# EAGLE design oc76 v3 (EAGLE 9.3.0)
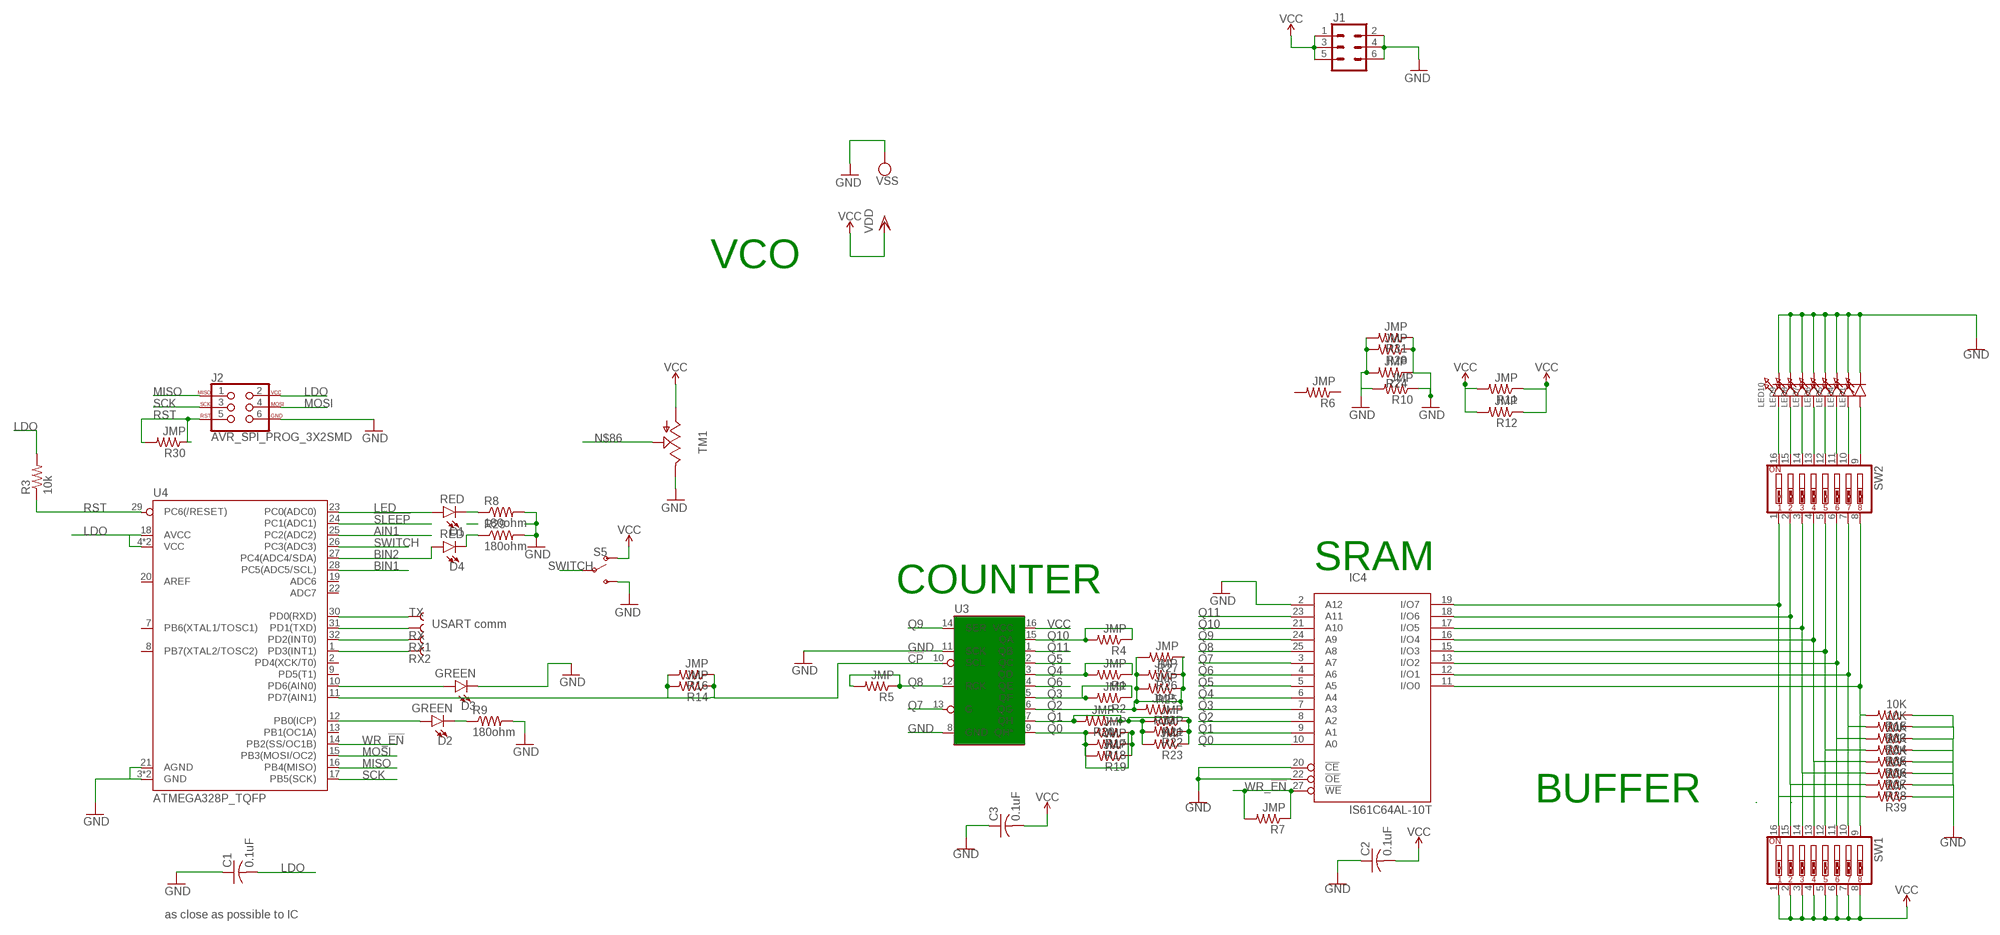
[diagram p0: schematic, sheet 1]

## Parts
C1  0.1uF  C-USC1206  [C1206]
C2  0.1uF  C-USC1206  [C1206]
C3  0.1uF  C-USC1206  [C1206]
D1  RED  LED-RED1206  [LED-1206]
D2  GREEN  LED-RED1206  [LED-1206]
D3  GREEN  LED-RED1206  [LED-1206]
D4  RED  LED-RED1206  [LED-1206]
IC4  IS61C64AL-10T  [TSOP-I-28]
J1  CONN_03X2FEMALE_SMD  [2X3_SMD]
J2  AVR_SPI_PROG_3X2SMD  [2X3_SMT_POSTS]
LED1  LED1206  [CHIPLED_1206]
LED4  LED1206  [CHIPLED_1206]
LED5  LED1206  [CHIPLED_1206]
LED6  LED1206  [CHIPLED_1206]
LED7  LED1206  [CHIPLED_1206]
LED8  LED1206  [CHIPLED_1206]
LED9  LED1206  [CHIPLED_1206]
LED10  LED1206  [CHIPLED_1206]
R1  JMP  R-US_M1206  [M1206]
R2  JMP  R-US_M1206  [M1206]
R3  10k  R-US_R1206  [R1206]
R4  JMP  R-US_M1206  [M1206]
R5  JMP  R-US_M1206  [M1206]
R6  JMP  R-US_M1206  [M1206]
R7  JMP  R-US_M1206  [M1206]
R8  180ohm  R-US_R1206  [R1206]
R9  180ohm  R-US_R1206  [R1206]
R10  JMP  R-US_M1206  [M1206]
R11  JMP  R-US_M1206  [M1206]
R12  JMP  R-US_M1206  [M1206]
R13  JMP  R-US_M1206  [M1206]
R14  JMP  R-US_M1206  [M1206]
R15  10K  R-US_M1206  [M1206]
R16  JMP  R-US_M1206  [M1206]
R17  JMP  R-US_M1206  [M1206]
R18  JMP  R-US_M1206  [M1206]
R19  JMP  R-US_M1206  [M1206]
R20  JMP  R-US_M1206  [M1206]
R21  JMP  R-US_M1206  [M1206]
R22  JMP  R-US_M1206  [M1206]
R23  JMP  R-US_M1206  [M1206]
R24  JMP  R-US_M1206  [M1206]
R25  JMP  R-US_M1206  [M1206]
R26  JMP  R-US_M1206  [M1206]
R27  JMP  R-US_M1206  [M1206]
R28  JMP  R-US_M1206  [M1206]
R29  180ohm  R-US_R1206  [R1206]
R30  JMP  R-US_M1206  [M1206]
R31  JMP  R-US_M1206  [M1206]
R33  10K  R-US_M1206  [M1206]
R34  10K  R-US_M1206  [M1206]
R35  10K  R-US_M1206  [M1206]
R36  10K  R-US_M1206  [M1206]
R37  10K  R-US_M1206  [M1206]
R38  10K  R-US_M1206  [M1206]
R39  10K  R-US_M1206  [M1206]
RX  TEST-POINT3  [PAD.03X.03]
RX1  TEST-POINT3  [PAD.03X.03]
RX2  TEST-POINT3  [PAD.03X.03]
S5  SWITCH-SPDT-SMD-AYZ0202  [SWITCH_DPDT_SMD_AYZ0202]
SW1  DIP-08-SMT-HALFSIZE  [DIPSWITCH-08-50MIL]
SW2  DIP-08-SMT-HALFSIZE  [DIPSWITCH-08-50MIL]
TM1  TRIM  [6MM]
TX  TEST-POINT3  [PAD.03X.03]
U3  74595  [TSSOP16]
U4  ATMEGA328P_TQFP  [TQFP32-08]

## Nets
!CP: R14.1 R14.2 R16.1 R16.2 U3.10(SCL) U4.11(PD7(AIN1))
!SLEEP: U4.24(PC1(ADC1))
AIN1: U4.25(PC2(ADC2))
BIN1: U4.28(PC5(ADC5/SCL))
BIN2: D4.A U4.27(PC4(ADC4/SDA))
GND: C1.1 C2.1 C3.1 D3.C IC4.2(A12) IC4.20(!CE) IC4.22(!OE) J1.2 J1.4 J1.6 J2.6 LED1.C LED4.C LED5.C LED6.C LED7.C LED8.C LED9.C LED10.C R8.2 R9.2 R10.1 R10.2 R15.1 R24.1 R24.2 R28.1 R28.2 R29.2 R31.1 R31.2 R33.1 R34.1 R35.1 R36.1 R37.1 R38.1 R39.1 S5.3(S) TM1.E U3.8(GND) U3.11(SCK) U4.3(GND) U4.5(GND) U4.21(AGND) ; supply symbol labelled VSS
LDO: C1.2 J2.2 R3.2 U4.4(VCC) U4.6(VCC) U4.18(AVCC)
LED: D1.A U4.23(PC0(ADC0))
MISO: J2.1 U4.16(PB4(MISO))
MOSI: J2.4 U4.15(PB3(MOSI/OC2))
N$2: D4.C R29.1
N$3: RX1.P$1 U4.32(PD2(INT0))
N$4: RX2.P$1 U4.1(PD3(INT1))
N$5: D3.A U4.10(PD6(AIN0))
N$14: TX.P$1 U4.30(PD0(RXD))
N$15: RX.P$1 U4.31(PD1(TXD))
N$16: D2.A U4.12(PB0(ICP))
N$17: D1.C R8.1
N$18: D2.C R9.1
N$37: IC4.19(I/O7) R39.2 SW1.16 SW2.1
N$46: IC4.16(I/O4) R36.2 SW1.13 SW2.4
N$47: IC4.18(I/O6) R38.2 SW1.15 SW2.2
N$48: IC4.17(I/O5) R37.2 SW1.14 SW2.3
N$49: IC4.15(I/O3) R35.2 SW1.12 SW2.5
N$50: IC4.13(I/O2) R34.2 SW1.11 SW2.6
N$51: IC4.12(I/O1) R33.2 SW1.10 SW2.7
N$52: IC4.11(I/O0) R15.2 SW1.9 SW2.8
N$53: LED4.A SW2.10
N$55: LED5.A SW2.11
N$57: LED10.A SW2.16
N$58: LED9.A SW2.15
N$59: LED8.A SW2.14
N$60: LED7.A SW2.13
N$61: LED6.A SW2.12
N$62: LED1.A SW2.9
N$86: TM1.S
Q0: IC4.10(A0) R17.1 R17.2 R18.1 R18.2 R19.1 R19.2 U3.9(QH*)
Q1: IC4.9(A1) R20.1 R20.2 R21.1 R21.2 R22.1 R22.2 R23.1 R23.2 U3.7(QH)
Q2: IC4.8(A2) R13.1 R13.2 R25.1 R25.2 R26.1 R26.2 R27.1 R27.2 U3.6(QG)
Q3: IC4.7(A3) R2.1 R2.2 U3.5(QF)
Q4: IC4.6(A4) R1.1 R1.2 U3.3(QD)
Q5: IC4.5(A5) U3.2(QC)
Q6: IC4.4(A6) U3.4(QE)
Q7: IC4.3(A7) U3.13(G)
Q8: IC4.25(A8) R5.1 R5.2 U3.12(RCK)
Q9: IC4.24(A9) U3.14(SER)
Q10: IC4.21(A10) R4.1 R4.2 U3.15(QA)
Q11: IC4.23(A11) U3.1(QB)
RST: J2.5 R3.1 R30.1 R30.2 U4.29(PC6(/RESET))
SCK: J2.3 U4.17(PB5(SCK))
SWITCH: S5.2(P) U4.26(PC3(ADC3))
VCC: C2.2 C3.2 J1.1 J1.3 J1.5 R11.1 R11.2 R12.1 R12.2 S5.1(O) SW1.1 SW1.2 SW1.3 SW1.4 SW1.5 SW1.6 SW1.7 SW1.8 TM1.A U3.16(VCC) ; supply symbol labelled VDD
WR_!EN: IC4.27(!WE) R7.1 R7.2 U4.14(PB2(SS/OC1B))
Unconnected: R6.1 R6.2 U4.2(PD4(XCK/T0)) U4.7(PB6(XTAL1/TOSC1)) U4.8(PB7(XTAL2/TOSC2)) U4.9(PD5(T1)) U4.13(PB1(OC1A)) U4.19(ADC6) U4.20(AREF) U4.22(ADC7)

## Notes on the sheet
- VCO
- SRAM
- COUNTER
- USART comm
- BUFFER
- as close as possible to IC

## Power pins joined to a net without a drawn wire
GND: IC4.14(GND)
VDD: IC4.28(VDD)

## Library data of the parts
C1-C3 = adafruit:C-US: CAPACITOR, American symbol
D1 D4 = SparkFun-LED:LED-RED: Red SMD LED Used in manufacturing of most products at SparkFun Packages: 0603 - SMD 0603 package [Product Link] <http://docs.avagotech.com/docs/AV02-0551EN> 0603 SMART - SMD 0603 SMART package ( more efficient and expensive)[Product Link] <http://www.osram-os.com/Graphics/XPic2/00077099_0.pdf> 1206 - SMD1206 package [Product Link] <https://www.sparkfun.com/datasheets/DevTools/LilyPad/Q150OVS4.pdff> SparkFun Products: Pro Mini 328 -5V <https://www.sparkfun.com/products/821> RedBoard <https://www.sparkfun.com/products/12757> IOIO-OTG <https://www.sparkfun.com/products/13613>; PROD_ID: DIO-09912
D2 D3 = SparkFun-LED:LED-RED: Red SMD LED Used in manufacturing of most products at SparkFun Packages: 0603 - SMD 0603 package [Product Link] <http://docs.avagotech.com/docs/AV02-0551EN> 0603 SMART - SMD 0603 SMART package ( more efficient and expensive)[Product Link] <http://www.osram-os.com/Graphics/XPic2/00077099_0.pdf> 1206 - SMD1206 package [Product Link] <https://www.sparkfun.com/datasheets/DevTools/LilyPad/Q150OVS4.pdff> SparkFun Products: Pro Mini 328 -5V <https://www.sparkfun.com/products/821> RedBoard <https://www.sparkfun.com/products/12757> IOIO-OTG <https://www.sparkfun.com/products/13613>; PROD_ID: DIO-09912; VALUE: RED
IC4 = memory-issi-asynsram:IS61C64AL-*: 8k x 8 high- speed CMOS static RAM 10ns access time 5V power supply
J1 = SparkFun-Connectors:CONN_03X2: Multi connection point. Often used as Generic Header-pin footprint for 0.1 inch spaced/style header connections You can populate with any combo of single row headers, but if you'd like an exact match, check these: Header - 2x3 (Male, 0.1") <https://www.sparkfun.com/products/12807> (PRT-12807) Header - 2x3 (Female, 0.1") <https://www.sparkfun.com/products/13010> (PRT-13010) 2x3 Pin Shrouded Header <https://www.sparkfun.com/products/10877> (PRT-10877) On any of the 0.1 inch spaced packages, you can populate with these: Break Away Headers - Straight <https://www.sparkfun.com/products/116> (PRT-00116) Break Away Male Headers - Right Angle <https://www.sparkfun.com/products/553> (PRT-00553) Female Headers <https://www.sparkfun.com/products/115> (PRT-00115) Break Away Headers - Machine Pin <https://www.sparkfun.com/products/117> (PRT-00117) Break Away Female Headers - Swiss Machine Pin <https://www.sparkfun.com/products/743> (PRT-00743) Special note: the shrouded connector mates well with our 3x2 ribbon cables: Ribbon Crimp Connector - 6-pin (2x3, Female) <https://www.sparkfun.com/products/10651> (PRT-10651) Ribbon Cable - 6 wire (15ft) <https://www.sparkfun.com/products/10646> (PRT-10646); PROD_ID: CONN-11290
J2 = SparkFun-Connectors:AVR_SPI_PROG_3X2: AVR ISP 6 Pin This is the reduced ISP connector for AVR programming. Common on Arduino. This footprint will take up less PCB space and can be used with a 10-pin to 6-pin adapter such as SKU: BOB-08508 **Special note about "TEST_POINT" package. The stop mask is on the top side, so if you want your programming test points to be on the bottom of your board, make sure to place this package on the bottom side of the board. This also ensure that the orientation to program from the bottom side will be correct. SparkFun Products: SparkFun ISP Pogo Adapter <https://www.sparkfun.com/products/11591> - NS Tiny AVR Programmer <https://www.sparkfun.com/products/11801> -PTH
LED1 LED4-LED10 = microbuilder:LED: LED 0603 - 0603 Surface Mount Package 2mA: Green LED - Low Power (3.9mcd, 2ma, 1.7Vf) - Digikey: 475-2709-2-ND Orange LED - Low Power (9.8mcd, 2ma, 1.8Vf) - Digikey: 475-1194-2-ND Red LED - Low Power (5mcd, 2ma, 1.8Vf) - Digikey: 475-1195-2-ND Yellow LED - Low Power (7mcd, 2ma, 1.8Vf) - Digikey: 475-1196-2-ND 5mA: Blue LED - Low Power (17mcd, 5ma, 2.9Vf) - Digikey: LNJ937W8CRACT-ND 0805 - 0805 Surface Mount Package 2mA: Red LED (8.8mcd, 2mA, 1.8Vf, Clear) - Low Power [Digikey: 475-2510-1-ND] Green LED (5mcd, 2mA, 1.8Vf, Clear) - Low Power [Digikey: 475-2730-1-ND] Yellow LED (11.3mcd, 2mA, 1.8Vf, Clear) - Low Power [Digikey: 475-2555-1-ND] 20mA: Red LED (104mcd, 20mA, Diffused) - LS R976 [Digikey: 475-1278-6-ND] Red LED (12mcd, 20mA, 2.0Vf, Clear) - APT2012EC [Digikey: 754-1128-1-ND] Green LED (15mcd, 20mA, 2.2Vf, Clear) - APT2012GC [Digikey: 754-1131-1-ND] Orange LED (160mcd, 20mA, 2.1Vf, Clear) - APT2012SECK [Digikey: 754-1130-1-ND] 1206 - 1206 Surface Mount Package Green LED (26mcd, 20mA, Diffused) - LG N971 [Digikey: 475-1407-6-ND] Red LED (15mcd, 20mA, Diffused) - LH N974 [Digikey: 475-1416-6-ND]
R1-R31 R33-R39 = adafruit:R-US_: RESISTOR, American symbol
RX RX1 RX2 TX = SparkFun-Connectors:TEST-POINT: SparkFun Test Points Bare copper test points for troubleshooting or In-Circuit-Testing. These are used by our Production team for verifying production board runs using pogo-pins on test beds. SparkFun Products: SparkFun LSM9DS1 Breakout <https://www.sparkfun.com/products/13284> SparkFun PSOC <https://www.sparkfun.com/products/13714> SparkFun Load Cell Amplifier <https://www.sparkfun.com/products/13879>
S5 = SparkFun-Switches:SWITCH-SPDT: Single Pole, Double Throw (SPDT) Switch Single-pole, double-throw (SPDT) switch. Variant Overview SMD-AYZ0202 Surface Mount DPDT Switch <https://www.sparkfun.com/products/597> (COM-00597) Used on e.g. LilyPad Arduino USB - ATmega32U4 Board <https://www.sparkfun.com/products/12049> PTH-11.6X4.0MM SPDT Mini Power Switch <https://www.sparkfun.com/products/102> (COM-00102) Used on e.g. SparkFun Simon Says - Through-Hole Soldering Kit <https://www.sparkfun.com/products/10547> (KIT-10547) PTH-11.6X4.0MM-KIT KIT version of SPDT Mini Power Switch - Simplifies soldering by removing tStop of switch pins - only one side can be soldered. PTH-11.6X4.0MM-LOCK LOCK version of SPDT Mini Power Switch - Offset pins hold switch in place for easier soldering. SMD-RIGHT-ANGLE Surface Mount Right Angle Switch <https://www.sparkfun.com/products/10860> (COM-10860) Used on e.g. SparkFun ESP8266 Thing <https://www.sparkfun.com/products/13231>; PROD_ID: SWCH-08179; SF_ID: COM-00597
SW1 SW2 = SparkFun-Retired:DIP-08: DIP Switch 8 Position
TM1 = adafruit:TRIM
U3 = SparkFun-IC-Logic:74*595: 8-Bit Shift Register (Serial to Parallel) Datasheet <http://cdn.sparkfun.com/datasheets/BreakoutBoards/MM74HC595.pdf> SparkFun Products SparkFun Shift Register Breakout - 74HC595 <https://www.sparkfun.com/products/10680> (BOB-10680)
U4 = SparkFun-IC-Microcontroller:ATMEGA328P_TQFP: Popular 328P in QFP Storefront component: ATmega328 - TQFP <https://www.sparkfun.com/products/13448> (COM-13448) Datasheet <http://www.sparkfun.com/datasheets/Components/SMD/ATMega328.pdf> SparkFun Products SparkFun RedBoard - Programmed with Arduino <https://www.sparkfun.com/products/12757> (DEV-12757) Arduino Pro Mini 328 - 5V/16MHz <https://www.sparkfun.com/products/11113> (DEV-11113) Arduino Pro Mini 328 - 3.3V/8MHz <https://www.sparkfun.com/products/11114> (DEV-11114) SparkFun OpenLog <https://www.sparkfun.com/products/13712> (DEV-13712) SparkFun MicroView - OLED Arduino Module <https://www.sparkfun.com/products/12923> (DEV-12923) SparkFun Digital Sandbox <https://www.sparkfun.com/products/12651> (DEV-12651) SparkFun PicoBoard <https://www.sparkfun.com/products/11888> (WIG-11888) Arduino Fio <https://www.sparkfun.com/products/10116> (DEV-10116) LilyPad Arduino 328 Main Board <https://www.sparkfun.com/products/13342> (DEV-13342) SparkFun RedStick <https://www.sparkfun.com/products/13741> (DEV-13741) LilyPad MP3 <https://www.sparkfun.com/products/11013> (DEV-11013) LilyPad Arduino SimpleSnap <https://www.sparkfun.com/products/10941> (DEV-10941) SparkFun Stepoko <https://www.sparkfun.com/products/13899> (ROB-13899) SparkFun Geiger Counter <https://www.sparkfun.com/products/11345> (SEN-11345) SparkFun EL Sequencer <https://www.sparkfun.com/products/12781> (COM-12781) Arduino Pro 328 - 5V/16MHz <https://www.sparkfun.com/products/10915> (DEV-10915) CryptoCape <https://www.sparkfun.com/products/12773> (DEV-12773) SparkFun IR Thermometer Evaluation Board - MLX90614 <https://www.sparkfun.com/products/10740> (SEN-10740) SparkFun RedBot Mainboard <https://www.sparkfun.com/products/12097> (ROB-12097) Arduino Pro 328 - 3.3V/8MHz <https://www.sparkfun.com/products/10914> (DEV-10914) SparkFun Block for Intel® Edison - Arduino <https://www.sparkfun.com/products/13036> (DEV-13036) SparkFun Simon Says - Surface Mount Soldering Kit <https://www.sparkfun.com/products/10935> (KIT-10935) SparkFun 7-Segment Serial Display - Red <https://www.sparkfun.com/products/11441> (COM-11441) SparkFun 7-Segment Serial Display - White <https://www.sparkfun.com/products/11629> (COM-11629) SparkFun 7-Segment Serial Display - Yellow <https://www.sparkfun.com/products/11443> (COM-11443) SparkFun 7-Segment Serial Display - Kelly Green <https://www.sparkfun.com/products/11440> (COM-11440) SparkFun 7-Segment Serial Display - Blue <https://www.sparkfun.com/products/11442> (COM-11442) SparkFun OpenSegment Serial Display - 20mm (Blue) <https://www.sparkfun.com/products/11647> (COM-11647) SparkFun OpenSegment Serial Display - 20mm (Green) <https://www.sparkfun.com/products/11646> (COM-11646) SparkFun OpenSegment Serial Display - 20mm (White) <https://www.sparkfun.com/products/11648> (COM-11648) SparkFun OpenSegment Serial Display - 20mm (Red) <https://www.sparkfun.com/products/11644> (COM-11644) SparkFun OpenSegment Serial Display - 20mm (Yellow) <https://www.sparkfun.com/products/11645> (COM-11645) SparkFun OpenSegment Shield <https://www.sparkfun.com/products/13190> (DEV-13190); PROD_ID: IC-09069

## Board
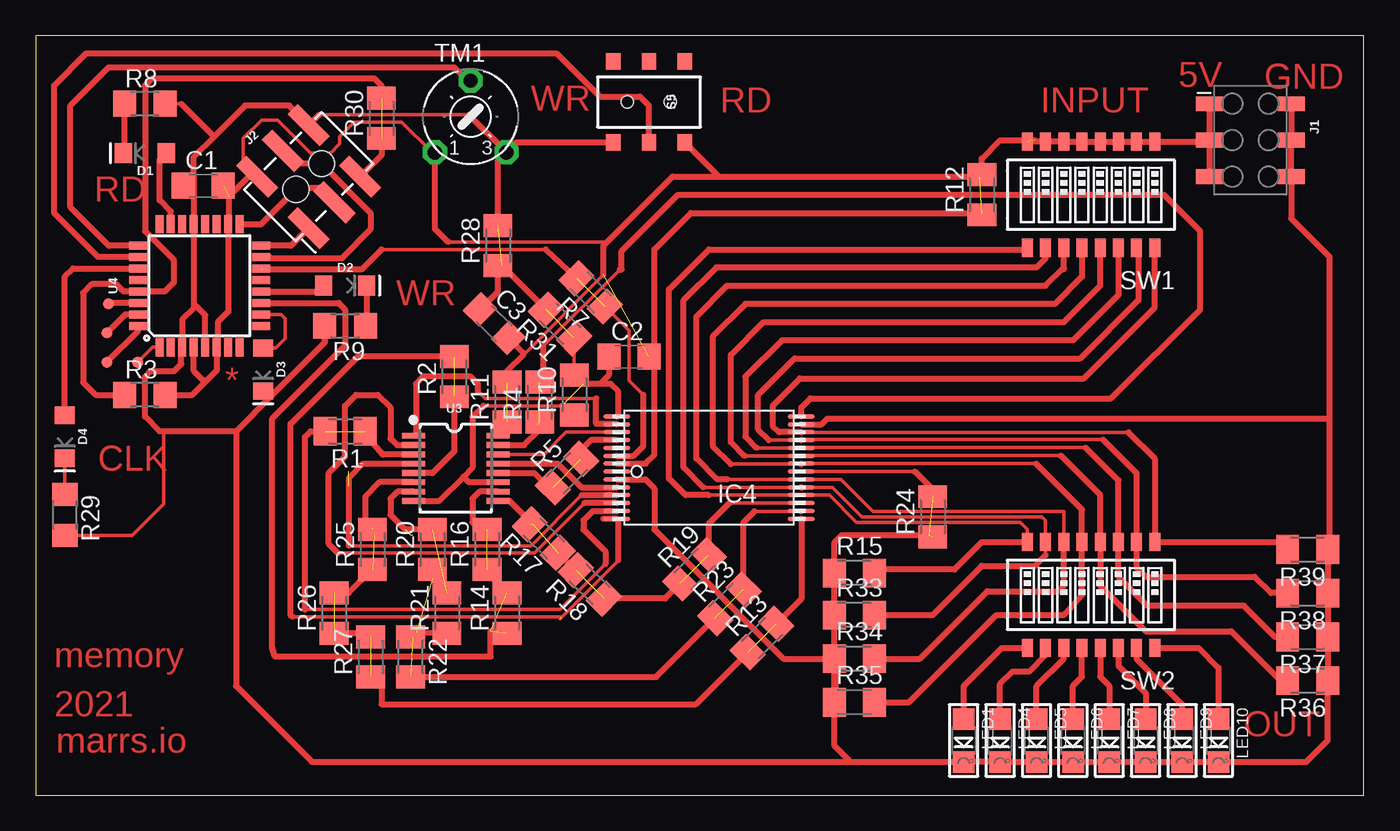
[diagram p1: board, top side]

Size 92.69 x 53.01 mm. Coordinates in mm from the lower left corner, seen from the top.
Outline: 0,0 92.69,0 92.69,53.01 0,53.01 0,0
Copper layers (1*16): Top 0.035mm / dielectric 1.5mm / Bottom 0.035mm
Design rules "default *": minimum track width 10mil, minimum drill 0.35mm, track to track 6mil, track to pad 6mil, pad to pad 6mil, via to via 6mil, smd to smd 6mil, copper to edge 40mil, drill to drill 6mil, minimum pad ring 10mil, minimum via ring 8mil, stop-mask expansion 4mil, vias tented up to drill 0mil, thermal gap 10mil

### Footprints (pad centres in the part's own frame; a part is rotated, then mirrored left to right if it is on the bottom)
C1206 = smd 1.6 x 1.8: 1 -1.4,0; 2 1.4,0
LED-1206 = smd 1.2 x 1.4: A -1.5,0; C 1.5,0
TSOP-I-28 = smd 0.33 x 1.9: 1 -0.275,6.45; 2 -0.825,6.45; 3 -1.375,6.45; 4 -1.925,6.45; 5 -2.475,6.45; 6 -3.025,6.45; 7 -3.575,6.45; 8 -3.575,-6.45; 9 -3.025,-6.45; 10 -2.475,-6.45; 11 -1.925,-6.45; 12 -1.375,-6.45; 13 -0.825,-6.45; 14 -0.275,-6.45; 15 0.275,-6.45; 16 0.825,-6.45; 17 1.375,-6.45; 18 1.925,-6.45; 19 2.475,-6.45; 20 3.025,-6.45; 21 3.575,-6.45; 22 3.575,6.45; 23 3.025,6.45; 24 2.475,6.45; 25 1.925,6.45; 26 1.375,6.45; 27 0.825,6.45; 28 0.275,6.45
2X3_SMD = smd 1.02 x 1.9: 1 -2.54,-2.85; 2 -2.54,2.85; 3 0,-2.85; 4 0,2.85; 5 2.54,-2.85; 6 2.54,2.85
2X3_SMT_POSTS = smd 1 x 3.17: 1 -2.54,-2.54; 2 -2.54,2.54; 3 0,-2.54; 4 0,2.54; 5 2.54,-2.54; 6 2.54,2.54 | hole 1.8: -1.27,0; 1.27,0
CHIPLED_1206 = smd 1.5 x 1.5: A 0,-1.496; C 0,1.496
M1206 = smd 1.6 x 2: 1 -1.4,0; 2 1.4,0
R1206 = smd 1.6 x 1.803: 1 -1.422,0; 2 1.422,0
PAD.03X.03 = smd 0.762 x 0.762: P$1 0,0
SWITCH_DPDT_SMD_AYZ0202 = smd 1 x 1.15: 1 -2.5,2.825; 2 0,2.825; 3 2.5,2.825; 4 -2.5,-2.825; 5 0,-2.825; 6 2.5,-2.825 | hole 0.85: 1.5,0; -1.5,0
DIPSWITCH-08-50MIL = smd 0.762 x 1.27: 1 -4.445,-3.7; 2 -3.175,-3.7; 3 -1.905,-3.7; 4 -0.635,-3.7; 5 0.635,-3.7; 6 1.905,-3.7; 7 3.175,-3.7; 8 4.445,-3.7; 9 4.445,3.7; 10 3.175,3.7; 11 1.905,3.7; 12 0.635,3.7; 13 -0.635,3.7; 14 -1.905,3.7; 15 -3.175,3.7; 16 -4.445,3.7
6MM = drill 1 pad 1.676 octagon: A -2.5,-2.5; E 2.5,-2.5; S 0,2.5
TSSOP16 = smd 0.4 x 1.6: 1 -2.225,-2.85; 2 -1.575,-2.85; 3 -0.925,-2.85; 4 -0.275,-2.85; 5 0.375,-2.85; 6 1.025,-2.85; 7 1.675,-2.85; 8 2.325,-2.85; 9 2.325,3.05; 10 1.675,3.05; 11 1.025,3.05; 12 0.375,3.05; 13 -0.275,3.05; 14 -0.925,3.05; 15 -1.575,3.05; 16 -2.225,3.05
TQFP32-08 = smd 1.27 x 0.559: 1 -4.293,2.8; 2 -4.293,2; 3 -4.293,1.2; 4 -4.293,0.4; 5 -4.293,-0.4; 6 -4.293,-1.2; 7 -4.293,-2; 8 -4.293,-2.8; 17 4.293,-2.8; 18 4.293,-2; 19 4.293,-1.2; 20 4.293,-0.4; 21 4.293,0.4; 22 4.293,1.2; 23 4.293,2; 24 4.293,2.8 | smd 0.559 x 1.27: 9 -2.8,-4.293; 10 -2,-4.293; 11 -1.2,-4.293; 12 -0.4,-4.293; 13 0.4,-4.293; 14 1.2,-4.293; 15 2,-4.293; 16 2.8,-4.293; 25 2.8,4.293; 26 2,4.293; 27 1.2,4.293; 28 0.4,4.293; 29 -0.4,4.293; 30 -1.2,4.293; 31 -2,4.293; 32 -2.8,4.293

### Placement (x,y rotation side)
C1  11.68,42.55 0 top
C2  41.4,30.61 0 top
C3  31.99,32.91 315 top
D1  7.62,44.83 180 top
D2  21.59,35.56 0 top
D3  15.88,29.72 270 top
D4  2.03,25.02 270 top
IC4  46.99,22.86 90 top
J1  84.78,45.72 270 top
J2  19.05,43.18 45 top
LED1  64.77,3.81 180 top
LED4  67.31,3.81 180 top
LED5  69.85,3.81 180 top
LED6  72.39,3.81 180 top
LED7  74.93,3.81 180 top
LED8  77.47,3.81 180 top
LED9  80.01,3.81 180 top
LED10  82.55,3.81 180 top
R1  21.59,25.4 180 top
R2  29.21,29.21 90 top
R3  7.62,27.94 0 top
R4  35.18,27.43 90 top
R5  37.08,22.48 45 top
R6  73.66,64.77 0 top  (outside the outline)
R7  38.73,35.1 135 top
R8  7.62,48.26 0 top
R9  21.59,32.77 180 top
R10  37.59,27.94 90 top
R11  32.89,27.43 90 top
R12  66.04,41.91 90 top
R13  50.69,10.97 45 top
R14  32.89,12.7 90 top
R15  57.15,15.49 0 top
R16  31.5,17.14 90 top
R17  35.45,17.91 135 top
R18  38.67,14.72 135 top
R19  45.97,15.77 45 top
R20  27.69,17.14 90 top
R21  28.7,12.7 90 top
R22  26.16,9.65 270 top
R23  48.41,13.36 45 top
R24  62.61,19.43 90 top
R25  23.49,17.14 90 top
R26  20.83,12.7 90 top
R27  23.37,9.65 90 top
R28  32.26,38.35 90 top
R29  2.03,19.56 270 top
R30  24.13,47.24 90 top
R31  36.6,32.89 135 top
R33  57.15,12.57 0 top
R34  57.15,9.53 0 top
R35  57.15,6.48 0 top
R36  88.77,8 180 top
R37  88.77,11.05 180 top
R38  88.77,14.1 180 top
R39  88.77,17.14 180 top
RX  4.95,32.26 0 top
RX1  4.95,30.23 0 top
RX2  7.11,30.23 0 top
S5  42.8,48.39 180 top
SW1  73.66,41.91 180 top
SW2  73.66,13.97 180 top
TM1  30.35,47.37 0 top
TX  5.08,34.29 0 top
U3  29.21,22.86 270 top
U4  11.43,35.56 90 top

### Tracks (layer width: path | path; a pad name or v marks a point on that pad's centre or on a via)
!CP  (3 unrouted)
  Top 0.406: U3.10 30.96,21.19 30.48,20.7 30.48,19.05 30.98,18.55 R16.2 | U4.11 21.14,34.36 21.59,33.91 21.59,31.37 16.51,26.29 16.51,10.29 16.72,9.65 31.75,9.65 31.75,11.43 | R14.2 31.5,15.5 R16.1
AIN1
  Top 0.406: U4.25 5.1,38.36 2.41,41.05 2.41,48.13 5.08,50.8 29.21,50.8 29.87,50.14 30.48,49.53
BIN2
  Top 0.406: D4.A 2.03,36.2 2.6,36.76 U4.27
GND  (5 unrouted)
  Top 0.254: R10.1 36.7,27.18 31.24,27.18 | IC4.14 61.36,22.59 | 30.23,47.5 19.78,47.5 | R29.2 6.73,18.14 8.91,20.32 8.91,25.38 8.89,25.4 | 10.16,48.26 R8.2 | R31.1 R10.2 | D3.C 16.15,27.94 16.51,27.94
  Top 0.406: 40.56,26.42 IC4.22 40.64,26.53 40.64,28.19 40.13,28.7 39.37,28.7 | LED1.C LED4.C LED5.C LED6.C LED7.C LED8.C LED9.C LED10.C 88.67,2.31 90.17,3.81 R36.1 R37.1 R38.1 R39.1 90.3,17.27 90.3,26.16 | LED1.C 64.54,2.54 | R34.1 R33.1 R15.1 55.75,17.65 56.26,18.16 62.36,18.16 | R35.1 R34.1 | 55.88,8.89 R35.1 | 12.45,45.97 14.61,48.13 17.69,48.13 J2.6 19.78,47.5 | 12.45,45.97 11.03,44.56 11.03,43.18 | 11.03,43.18 U4.21 11.03,34.02 | 56.87,2.31 LED1.C | 55.75,5.46 55.75,3.43 56.87,2.31 | 55.75,5.46 R35.1 | U4.5 11.83,33.51 11.18,34.16 11.03,34.02 | 11.03,34.02 10.23,33.22 U4.3 10.16,31.2 10.16,30.1 9.65,29.59 8,29.59 7.62,29.21 7.62,26.42 8.64,25.4 8.89,25.4 13.97,25.4 | J1.2 J1.4 J1.6 87.63,40.26 90.3,37.59 90.3,26.16 | U3.8 28.15,20.53 29.85,22.23 | IC4.2 42.55,22.03 43.18,21.4 43.18,18.54 52.2,9.53 R34.1 | IC4.20 54.84,25.89 55.25,26.29 90.17,26.29 90.3,26.16 | 12.45,45.97 10.16,48.26 | R9.2 20.17,31.6 16.51,27.94 13.97,25.4 | 39.37,28.7 38.23,28.7 R10.2 | 29.85,22.23 30.48,22.86 30.48,26.42 31.24,27.18 | U3.11 30.23,21.84 29.85,22.23 | 13.97,25.4 13.97,7.62 19.28,2.31 56.87,2.31 | 55.75,5.46 | C1.1 10.92,43.18 11.03,43.18 | R24.2 62.61,21.34 61.36,22.59 | TM1.E 30.23,47.5 | S5.3 33.54,45.56 TM1.E | R28.2 32.26,44.28 TM1.E | R31.2 32.54,36.95 R28.1 32.26,35.16 C3.1 | C2.1 40,29.34 39.37,28.7
LDO  (1 unrouted)
  Top 0.406: J2.2 14.86,43.18 13.46,41.78 13.46,39.89 U4.18 13.43,33.75 12.7,33.02 12.7,31.34 U4.6 12.63,29.65 11.94,28.96 | U4.4 11.03,29.61 11.68,28.96 11.94,28.96 | R3.2 10.92,27.94 11.94,28.96
LED
  Top 0.406: U4.23 9.43,40.73 8.64,41.53 8.64,44.35 D1.A
MISO
  Top 0.406: J2.1 17.82,38.36 U4.16
MOSI
  Top 0.406: U4.15 16.29,37.56 16.38,37.47 21.34,37.47 23.37,39.5 23.37,40.64 19.94,44.07 18.16,44.07 J2.4
N$2
  Top 0.254: D4.C R29.1
N$3
  Top 0.406: RX1.P$1 7.14,32.41 U4.32
N$4
  Top 0.254: RX2.P$1 8.15,31.27 U4.1
N$5
  Top 0.254: U4.10 17.11,33.56 17.4,33.27 17.4,31.88 16.74,31.22 D3.A
N$14
  Top 0.406: U4.30 5.15,34.36 TX.P$1
N$15
  Top 0.406: U4.31 6.25,33.56 RX.P$1
N$16
  Top 0.406: U4.12 19.86,35.16 D2.A
N$17
  Top 0.406: D1.C 6.2,44.91 R8.1
N$18
  Top 0.406: D2.C 23.09,32.84 R9.1
N$37  (1 unrouted)
  Top 0.254: 76.27,25.33 53.47,25.33
  Top 0.406: 76.27,25.33 78.1,23.5 SW2.1 86.85,17.67 R39.2 | 53.47,25.33 53.45,25.34 | IC4.19 51.88,25.34 51.44,25.78 51.44,27.18 53.34,29.08 73.15,29.08 78.1,34.04 SW1.16
N$46  (2 unrouted)
  Top 0.254: 71.55,23.7 53.44,23.7 | 49.48,23.68 53.18,23.68
  Top 0.406: 71.55,23.7 74.3,20.95 SW2.4 74.3,14.61 77.47,11.43 83.44,11.43 86.87,8 R36.2 | 74.27,37.8 SW1.13 74.3,35.56 71.75,33.02 50.8,33.02 48.51,30.73 48.51,24.64 49.48,23.68
N$47
  Top 0.254: 53.47,24.82 74.5,24.82 | IC4.18 51.16,24.78
  Top 0.406: 74.5,24.82 76.83,22.48 SW2.2 76.83,15.88 77.47,15.24 85.09,15.24 86.23,14.1 R38.2 | IC4.18 53.47,24.82 | 51.16,24.78 50.42,25.53 50.42,27.94 52.96,30.48 72.9,30.48 76.96,34.54 76.96,38.22 76.73,38.44 76.86,38.31 SW1.15
N$48  (1 unrouted)
  Top 0.254: 53.46,24.26 73.28,24.26 | IC4.17 50.31,24.23
  Top 0.406: 73.28,24.26 75.56,21.97 SW2.3 75.56,15.24 77.6,13.21 84.32,13.21 86.48,11.05 R37.2 | 50.31,24.23 49.53,25.02 49.53,29.21 52.07,31.75 72.39,31.75 75.56,34.92 SW1.14
N$49  (1 unrouted)
  Top 0.254: 69.82,23.14 IC4.15 | 53.42,23.11 48.51,23.11
  Top 0.406: 69.82,23.14 73.02,19.94 SW2.5 73.02,13.97 71.88,12.7 71.75,12.57 67.06,12.57 60.96,6.48 R35.2 | IC4.15 53.42,23.11 | 48.51,23.11 47.24,24.38 47.24,32 49.53,34.29 71.12,34.29 73.02,36.2 SW1.12 73,37.93
N$50
  Top 0.254: SW2.6 71.75,19.81 58.42,19.81 56.2,22.03 IC4.13 48.26,22.03
  Top 0.406: SW2.6 71.75,14.61 71.37,14.22 66.42,14.22 61.72,9.53 R34.2 | 71.75,36.83 SW1.11 | 71.75,36.83 71.75,36.7 | 71.75,36.83 70.48,35.56 48.26,35.56 46.1,33.4 46.1,23.5 47.56,22.03 48.26,22.03
N$51
  Top 0.254: 46.59,21.48 IC4.12 55.6,21.48 57.66,19.43 70.23,19.43 70.48,19.18 SW2.7 70.48,16.76
  Top 0.406: 53.46,21.46 IC4.12 | SW1.10 70.48,37.47 69.85,36.83 47.5,36.83 45.21,34.54 45.21,22.86 46.59,21.48 | R33.2 62.61,12.57 66.04,16 69.72,16 70.48,16.76
N$52
  Top 0.254: 46.99,20.94 IC4.11 55.39,20.94 57.28,19.05 68.72,19.05 69.21,18.56 SW2.8
  Top 0.406: R15.2 58.8,15.75 64.13,15.75 66.06,17.67 SW2.8 | SW1.9 69.1,38.1 46.99,38.1 44.2,35.31 44.2,22.1 45.36,20.94 46.99,20.94
N$53
  Top 0.406: LED4.A 67.31,7.75 68.2,8.64 69.34,8.64 70.48,9.78 SW2.10
N$55
  Top 0.406: LED5.A 69.85,7.62 71.75,9.53 SW2.11
N$57
  Top 0.406: SW2.16 81.17,10.27 82.55,8.89 LED10.A
N$58
  Top 0.406: SW2.15 76.83,9.53 80.01,6.35 LED9.A
N$59
  Top 0.406: SW2.14 75.56,9.02 77.47,7.11 LED8.A
N$60
  Top 0.406: SW2.13 74.3,8.26 74.93,7.62 LED7.A
N$61
  Top 0.406: LED6.A 72.39,7.62 73.02,8.26 SW2.12
N$62
  Top 0.406: LED1.A 64.77,7.62 67.42,10.27 SW2.9
N$86
  Top 0.254: TM1.S 30.14,49.87 29.85,50.17
Q0  (4 unrouted)
  Top 0.254: IC4.10 48.43,20.39
  Top 0.406: U3.9 33.06,20.53 34.67,18.92 | 48.43,20.39 46.96,18.92 R19.2 | R19.1 43.94,13.73 R18.1 | R18.2 37.66,15.71 R17.1
Q1  (6 unrouted)
  Top 0.254: 50.16,19.81 53.42,19.81
  Top 0.406: IC4.9 53.42,19.81 | U3.7 25.25,21.19 24.76,20.7 24.76,19.56 25.78,18.55 R20.2 | R23.2 49.4,19.05 50.16,19.81 | R21.1 26.55,11.31 26.29,11.05 R22.1 | R22.2 43.3,8.25 R23.1 | R20.1 27.69,15.12 R21.2
Q2  (5 unrouted)
  Top 0.406: U3.6 26.35,21.84 24,21.84 22.99,20.83 22.99,18.67 23.49,18.67 23.62,18.16 23.62,18.29 | IC4.8 53.44,13.71 R13.2 | R13.1 46.08,6.35 24.13,6.35 24.13,7.49 R27.1 | R27.2 23.12,11.3 R26.1 | R26.2 21.85,14.1 R25.1
Q3  (2 unrouted)
  Top 0.254: 36.7,12.45 17.91,12.45 | 40.67,16.38 36.58,12.29
  Top 0.406: 39.61,19.28 IC4.7 40.67,19.16 40.67,16.38 | U3.5 27.69,22.48 29.21,24 R2.1 | R2.2 22.48,30.61 17.78,25.91 17.78,12.57 17.91,12.45
Q4  (1 unrouted)
  Top 0.254: 18.8,12.95 36.58,12.95 39.75,16.13
  Top 0.406: IC4.6 40.52,19.81 38.86,19.81 38.23,19.18 38.23,18.54 39.75,17.02 39.75,16.13 | 18.8,12.95 18.8,25.02 19.18,25.4 R1.2 | U3.3 24.22,23.78 24.26,23.75 23.37,24.77 R1.1
Q5
  Top 0.254: 38.29,20.39 34.8,16.89 21.08,16.89
  Top 0.406: IC4.5 38.29,20.39 | U3.2 25.22,24.44 24.76,24.89 24.76,27.05 23.88,27.94 22.35,27.94 21.59,27.18 21.59,23.62 20.45,22.48 20.45,17.53 21.08,16.89
Q6  (3 unrouted)
  Top 0.254: 38.1,20.94 34.56,17.4 21.84,17.4
  Top 0.406: 38.1,20.94 IC4.4 | 21.84,17.4 21.84,22.12 22.86,23.14 U3.4
Q7
  Top 0.406: U3.13 36.43,23.14 38.08,21.48 IC4.3
Q8  (1 unrouted)
  Top 0.406: U3.12 34.8,22.48 35.79,21.49 R5.1 | IC4.25 38.76,24.78 38.07,24.1 R5.2
Q9
  Top 0.254: U3.14 35.47,23.78 37.02,25.34 IC4.24
Q10  (2 unrouted)
  Top 0.254: 35.43,31.37 40.77,36.7
  Top 0.406: IC4.21 53.44,27.07 54.06,27.69 75.06,27.69 81.28,33.91 81.28,39.37 78.74,41.91 44.83,41.91 40.89,37.97 40.89,36.7 40.77,36.7 | U3.15 34.09,24.44 35.05,25.4 35.05,25.91 | 35.43,31.37 35.43,29.09 R4.2
Q11
  Top 0.254: 30.86,28.19 31.37,27.69 39.12,27.69
  Top 0.406: IC4.23 40.52,25.91 39.12,25.91 39.12,27.69 | U3.1 26.54,25.27 26.54,28.7 27.05,29.21 30.35,29.21 30.86,28.7 30.86,28.19
RST  (1 unrouted)
  Top 0.254: R30.1 24.13,45.72
  Top 0.406: 22.99,43.53 J2.5 24.13,44.67 24.13,45.72 | R3.1 4.17,27.94 3.3,28.8 3.3,35.05 3.92,35.67 5.61,35.67 6.12,35.16 U4.29 9,35.16 9.65,35.81 9.65,37.34 7.62,39.37 7.62,49.53 8.13,50.04 23.62,50.04 24.13,49.53 R30.2
SCK
  Top 0.406: U4.17 15.72,39.85 18.29,42.42 19.81,42.42 J2.3
SWITCH
  Top 0.406: U4.26 4.35,37.56 1.27,40.64 1.27,49.53 3.53,51.79 36.35,51.79 39.37,48.77 42.16,48.77 42.8,48.13 S5.2
VCC  (4 unrouted)
  Top 0.254: 34.04,30.73 39.62,36.32 | 28.78,38.61 39.88,38.61 | TM1.A 27.65,44.87 25.53,46.99 22.22,46.99 21.21,45.97 21.21,45.47 20.57,44.83 19.18,44.83 16.89,47.12 15.75,47.12 14.48,45.85 14.48,44.07 15.37,43.18
  Top 0.406: SW1.1 SW1.3 SW1.4 SW1.5 SW1.6 SW1.7 SW1.8 69.1,45.72 | SW1.2 SW1.1 | SW1.1 81.82,45.61 J1.3 | J1.1 J1.3 | J1.3 J1.5 | 33.02,25.4 32.71,25.09 U3.16 32.89,25.72 R11.1 | 69.74,45.72 67.31,45.72 66.04,44.45 R12.2 65.91,43.18 47.68,43.18 | R11.2 32.89,29.59 34.04,30.73 34.04,30.86 C3.2 | 39.62,36.32 39.62,38.35 39.88,38.61 44.45,43.18 47.68,43.18 | 28.78,38.61 27.85,39.54 TM1.A | S5.1 47.68,43.18
VDD
  Top 0.406: IC4.28 42.57,23.14 43.18,23.75 43.18,38.1 45.72,40.64 66.04,40.64
WR_!EN  (2 unrouted)
  Top 0.254: 42.42,27.94 41.4,28.96 41.4,32.43 R7.1 | 35.6,38.1 24.13,38.1
  Top 0.406: IC4.27 41.72,23.69 42.42,24.38 42.42,27.94 | R7.2 35.6,38.1 | 24.13,38.1 22.73,36.7 15.75,36.7

### Text on the board
Top: 5V | GND | WR | RD | INPUT | RD | WR | * | CLK | OUT | memory | 2021 | OUT | marrs.io